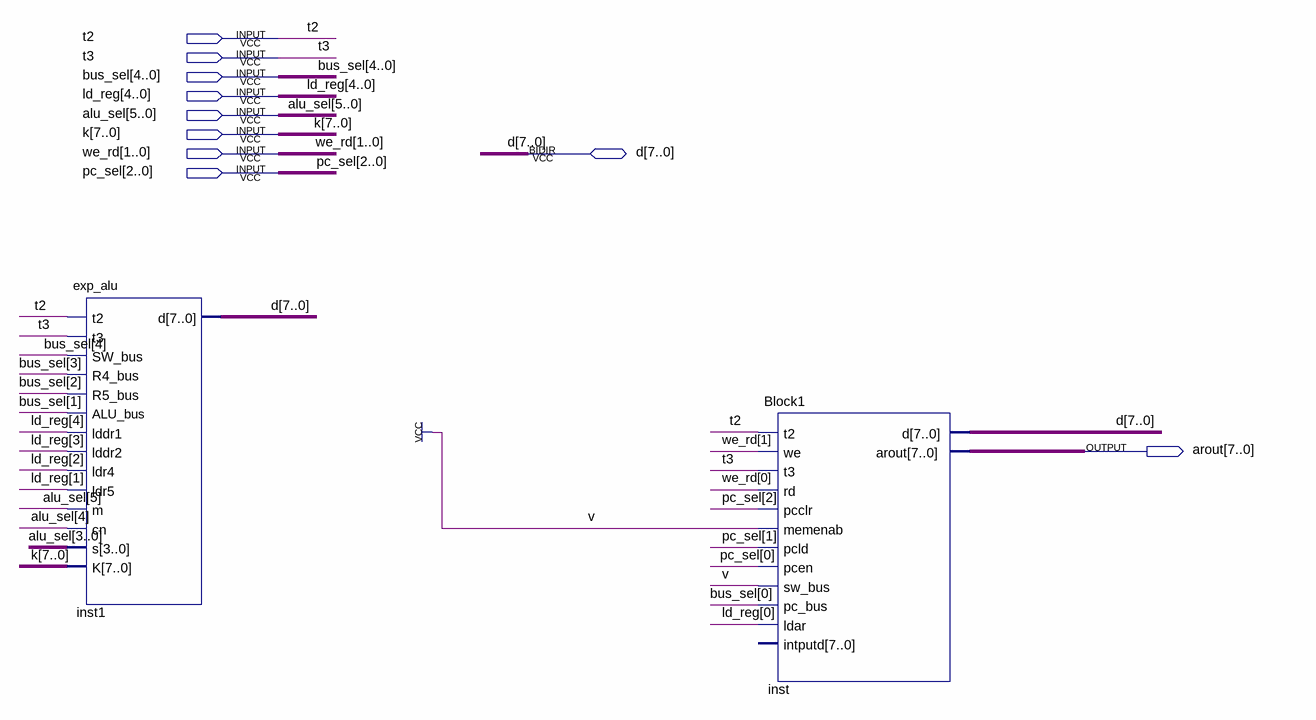
[diagram p0: schematic sheet]
// Quartus schematic sjtl.bdf as structural Verilog: 2 symbols, 10 pins
module sjtl (
  input  t2,
  input  t3,
  input  [4:0] bus_sel,
  input  [4:0] ld_reg,
  input  [5:0] alu_sel,
  input  [7:0] k,
  input  [1:0] we_rd,
  input  [2:0] pc_sel,
  inout  [7:0] d,
  output [7:0] arout
);

  exp_alu inst1 (
    .t2(t2), .t3(t3), .SW_bus(bus_sel[4]), .R4_bus(bus_sel[3]), .R5_bus(bus_sel[2]), .ALU_bus(bus_sel[1]),
    .lddr1(ld_reg[4]), .lddr2(ld_reg[3]), .ldr4(ld_reg[2]), .ldr5(ld_reg[1]), .m(alu_sel[5]),
    .cn(alu_sel[4]), .s(alu_sel[3:0]), .K(k), .d(d));
  Block1 inst (
    .t2(t2), .we(we_rd[1]), .t3(t3), .rd(we_rd[0]), .pcclr(pc_sel[2]), .memenab(1'b1), .pcld(pc_sel[1]),
    .pcen(pc_sel[0]), .sw_bus(1'b1), .pc_bus(bus_sel[0]), .ldar(ld_reg[0]), .arout(arout), .d(d));  // open: intputd
endmodule
